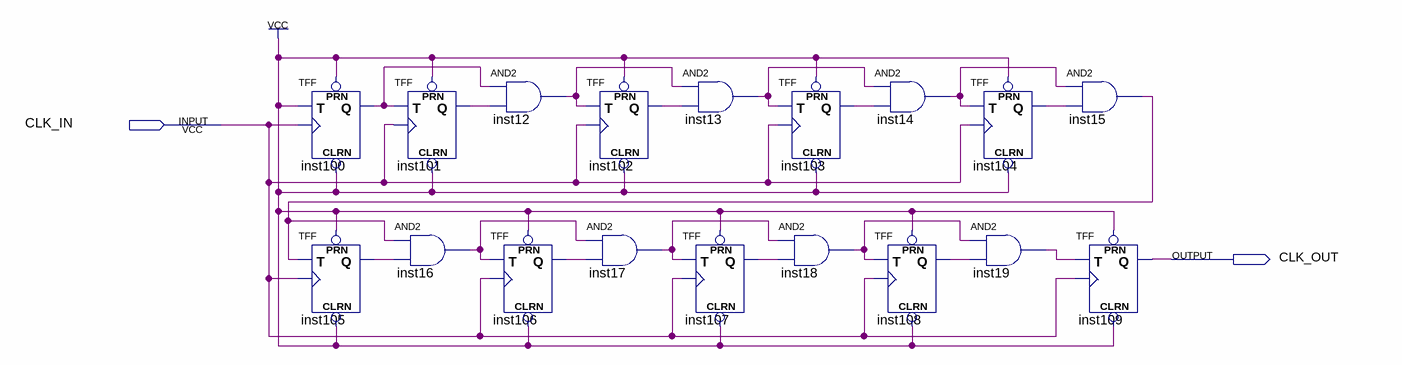
[diagram p0: schematic sheet]
// Quartus schematic clock_divider_1024.bdf as structural Verilog: 18 symbols, 2 pins
module clock_divider_1024 (
  input  CLK_IN,
  output CLK_OUT
);

  wire inst12_out, inst13_out, inst14_out, inst15_out, inst16_out, inst17_out, inst18_out, inst19_out,
       inst100_q, inst101_q, inst102_q, inst103_q, inst104_q, inst105_q, inst106_q, inst107_q, inst108_q;

  TFF inst100 (.PRN(1'b1), .CLRN(1'b1), .T(1'b1), .CLK(CLK_IN), .Q(inst100_q));
  TFF inst105 (.PRN(1'b1), .CLRN(1'b1), .T(inst15_out), .CLK(CLK_IN), .Q(inst105_q));
  TFF inst101 (.PRN(1'b1), .CLRN(1'b1), .T(inst100_q), .CLK(CLK_IN), .Q(inst101_q));
  and inst16 (inst16_out, inst15_out, inst105_q);
  and inst12 (inst12_out, inst100_q, inst101_q);
  TFF inst106 (.PRN(1'b1), .CLRN(1'b1), .T(inst16_out), .CLK(CLK_IN), .Q(inst106_q));
  TFF inst102 (.PRN(1'b1), .CLRN(1'b1), .T(inst12_out), .CLK(CLK_IN), .Q(inst102_q));
  and inst17 (inst17_out, inst16_out, inst106_q);
  and inst13 (inst13_out, inst12_out, inst102_q);
  TFF inst107 (.PRN(1'b1), .CLRN(1'b1), .T(inst17_out), .CLK(CLK_IN), .Q(inst107_q));
  TFF inst103 (.PRN(1'b1), .CLRN(1'b1), .T(inst13_out), .CLK(CLK_IN), .Q(inst103_q));
  and inst18 (inst18_out, inst17_out, inst107_q);
  and inst14 (inst14_out, inst13_out, inst103_q);
  TFF inst108 (.PRN(1'b1), .CLRN(1'b1), .T(inst18_out), .CLK(CLK_IN), .Q(inst108_q));
  TFF inst104 (.PRN(1'b1), .CLRN(1'b1), .T(inst14_out), .CLK(CLK_IN), .Q(inst104_q));
  and inst19 (inst19_out, inst18_out, inst108_q);
  and inst15 (inst15_out, inst14_out, inst104_q);
  TFF inst109 (.PRN(1'b1), .CLRN(1'b1), .T(inst19_out), .CLK(CLK_IN), .Q(CLK_OUT));
endmodule
